# EAGLE schematic TSB Rev1 (EAGLE 9.6.2)

## Sheet 1 of 3
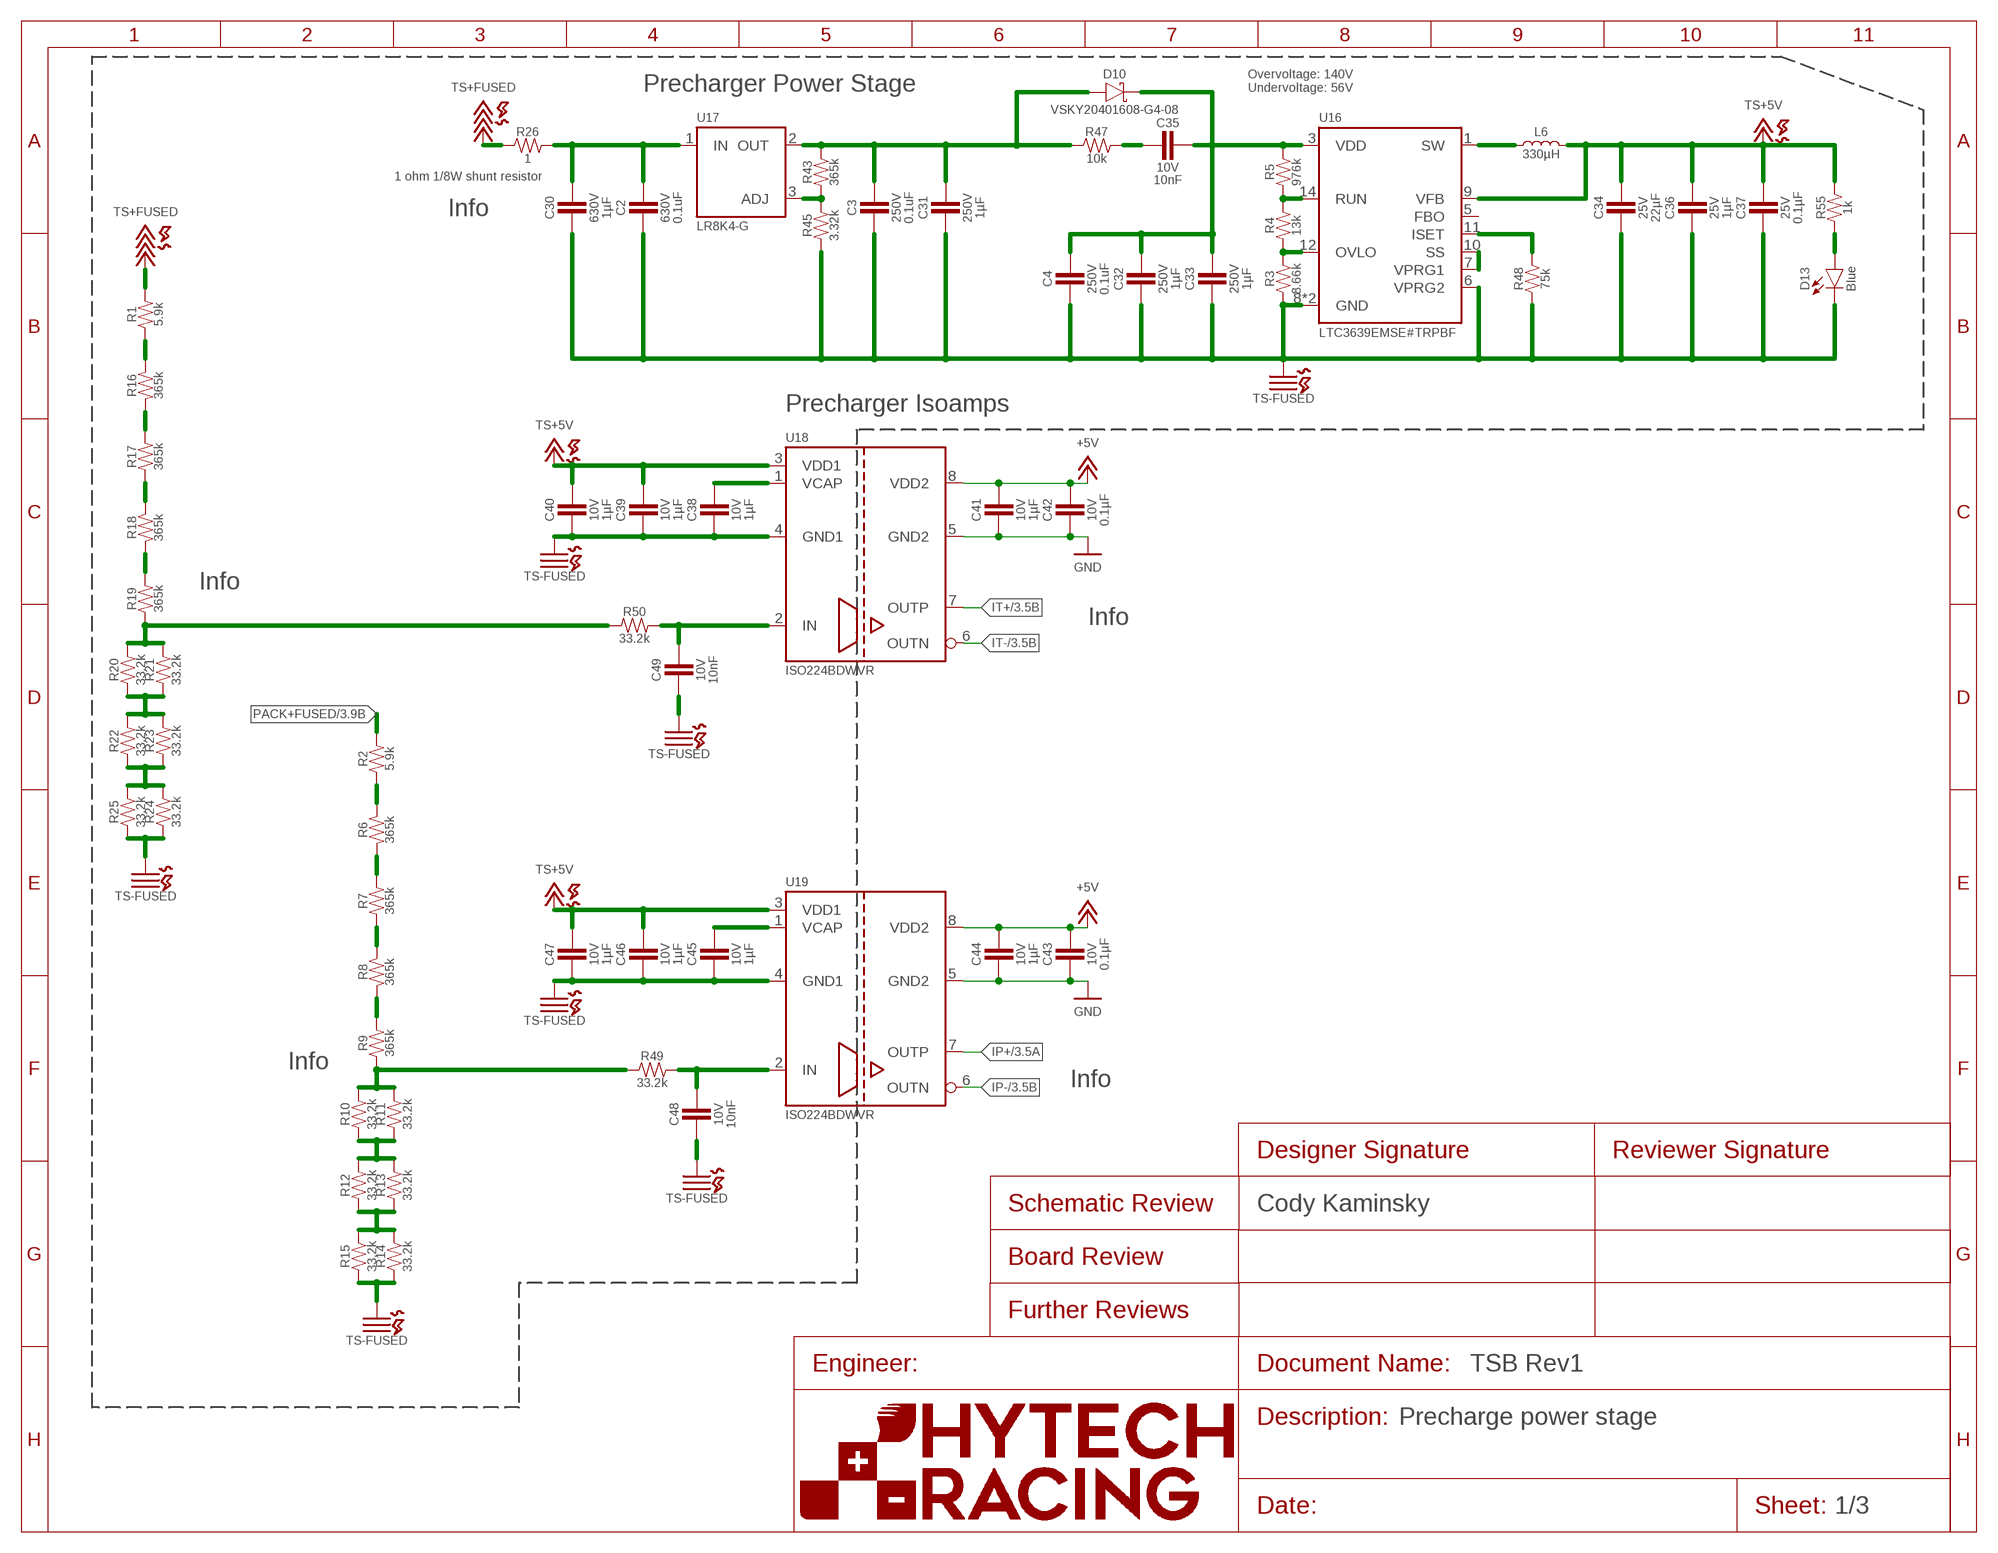
[diagram p0: schematic, sheet 1]
FRAME5 (FRAME): DESCRIPTION_1: Precharge power stage; DESIGNER_SCHEMATIC: Cody Kaminsky

### Parts
C2  CAPACITOR_2220_630V_0.1UF  [2220-CAP]
C3  CAPACITOR_1206_250V_0.1UF  [1206-CAP]
C4  CAPACITOR_1206_250V_0.1UF  [1206-CAP]
C30  CAPACITOR_2220_630V_1UF  [2220-CAP]
C31  CAPACITOR_2220_250V_1UF  [2220-CAP]
C32  CAPACITOR_2220_250V_1UF  [2220-CAP]
C33  CAPACITOR_2220_250V_1UF  [2220-CAP]
C34  CAPACITOR_0805_25V_22UF  [0805-CAP]
C35  CAPACITOR_0603_10V_10NF  [0603-CAP]
C36  CAPACITOR_0603_25V_1UF  [0603-CAP]
C37  CAPACITOR_0603_25V_0.1UF  [0603-CAP]
C38  CAPACITOR_0603_10V_1UF  [0603-CAP]
C39  CAPACITOR_0603_10V_1UF  [0603-CAP]
C40  CAPACITOR_0603_10V_1UF  [0603-CAP]
C41  CAPACITOR_0603_10V_1UF  [0603-CAP]
C42  CAPACITOR_0603_10V_0.1UF  [0603-CAP]
C43  CAPACITOR_0603_10V_0.1UF  [0603-CAP]
C44  CAPACITOR_0603_10V_1UF  [0603-CAP]
C45  CAPACITOR_0603_10V_1UF  [0603-CAP]
C46  CAPACITOR_0603_10V_1UF  [0603-CAP]
C47  CAPACITOR_0603_10V_1UF  [0603-CAP]
C48  CAPACITOR_0603_10V_10NF  [0603-CAP]
C49  CAPACITOR_0603_10V_10NF  [0603-CAP]
D10  SCHOTTKY  [CLP1608-2L]
D13  LED_0603_BLUE  [0603-LED]
L6  INDUCTOR_SRU1048_330UH  [SRU1048]
R1  RESISTOR_0603_5.9K  [0603-RES]
R2  RESISTOR_0603_5.9K  [0603-RES]
R3  RESISTOR_0603_8.66K  [0603-RES]
R4  RESISTOR_0603_13K  [0603-RES]
R5  RESISTOR_0805_976K  [0805-RES]
R6  RESISTOR_0805_365K  [0805-RES]
R7  RESISTOR_0805_365K  [0805-RES]
R8  RESISTOR_0805_365K  [0805-RES]
R9  RESISTOR_0805_365K  [0805-RES]
R10  RESISTOR_0603_33.2K  [0603-RES]
R11  RESISTOR_0603_33.2K  [0603-RES]
R12  RESISTOR_0603_33.2K  [0603-RES]
R13  RESISTOR_0603_33.2K  [0603-RES]
R14  RESISTOR_0603_33.2K  [0603-RES]
R15  RESISTOR_0603_33.2K  [0603-RES]
R16  RESISTOR_0805_365K  [0805-RES]
R17  RESISTOR_0805_365K  [0805-RES]
R18  RESISTOR_0805_365K  [0805-RES]
R19  RESISTOR_0805_365K  [0805-RES]
R20  RESISTOR_0603_33.2K  [0603-RES]
R21  RESISTOR_0603_33.2K  [0603-RES]
R22  RESISTOR_0603_33.2K  [0603-RES]
R23  RESISTOR_0603_33.2K  [0603-RES]
R24  RESISTOR_0603_33.2K  [0603-RES]
R25  RESISTOR_0603_33.2K  [0603-RES]
R26  RESISTOR_0805_1  [0805-RES]
R43  RESISTOR_0805_365K  [0805-RES]
R45  RESISTOR_0603_3.32K  [0603-RES]
R47  RESISTOR_0603_10K  [0603-RES]
R48  RESISTOR_0603_75K  [0603-RES]
R49  RESISTOR_0603_33.2K  [0603-RES]
R50  RESISTOR_0603_33.2K  [0603-RES]
R55  RESISTOR_0603_1K  [0603-RES]
U16  LTC3639  [MSE16(12)]
U17  VOLTAGE_REGULATOR_ADJ_LR8_DPAK  [DPAK(2-7K1S)]
U18  ISO224B_AIRGAP  [SOIC-08(WIDE,0.295")-AIRGAP]
U19  ISO224B_AIRGAP  [SOIC-08(WIDE,0.295")-AIRGAP]

### Nets
+5V: C41.1 C42.1 C43.1 C44.1 U18.8(VDD2) U19.8(VDD2) ; also sheet 2,3
GND: C41.2 C42.2 C43.2 C44.2 U18.5(GND2) U19.5(GND2) ; also sheet 2,3
IP+: U19.7(OUTP) ; also sheet 3
IP-: U19.6(OUTN) ; also sheet 3
IT+: U18.7(OUTP) ; also sheet 3
IT-: U18.6(OUTN) ; also sheet 3
N$2: R3.2 R4.1 U16.12(OVLO)
N$5: R4.2 R5.1 U16.14(RUN)
N$7: R6.2 R7.2
N$8: R7.1 R8.1
N$9: R1.1 R16.1
N$10: R2.1 R6.1
N$11: R8.2 R9.2
N$12: R20.1 R21.1 R22.2 R23.2
N$13: R9.1 R10.2 R11.2 R49.1
N$15: C2.1 C30.1 R26.2 U17.1(IN)
N$19: R16.2 R17.2
N$20: R17.1 R18.1
N$21: R18.2 R19.2
N$23: R19.1 R20.2 R21.2 R50.1
N$32: R12.1 R13.1 R14.2 R15.2
N$33: R22.1 R23.1 R24.2 R25.2
N$34: R10.1 R11.1 R12.2 R13.2
N$35: D13.2(A) R55.1
N$54: R43.1 R45.2 U17.3(ADJ)
N$58: C3.1 C31.1 D10.2(A) R43.2 R47.1 U17.2(OUT)
N$60: C35.2 R47.2
N$61: C4.1 C32.1 C33.1 C35.1 D10.1(C) R5.2 U16.3(VDD)
N$62: C48.1 R49.2 U19.2(IN)
N$63: C49.1 R50.2 U18.2(IN)
N$64: R48.2 U16.11(ISET)
N$65: L6.1 U16.1(SW)
N$69: C45.1 U19.1(VCAP)
N$73: C38.1 U18.1(VCAP)
N$76: U16.7(VPRG1) U16.10(SS)
PACK+FUSED: R2.2 ; also sheet 3
TS+5V: C34.1 C36.1 C37.1 C39.1 C40.1 C46.1 C47.1 L6.2 R55.2 U16.9(VFB) U18.3(VDD1) U19.3(VDD1) ; also sheet 3
TS+FUSED: R1.2 R26.1 ; also sheet 2,3
TS-FUSED: C2.2 C3.2 C4.2 C30.2 C31.2 C32.2 C33.2 C34.2 C36.2 C37.2 C38.2 C39.2 C40.2 C45.2 C46.2 C47.2 C48.2 C49.2 D13.1(C) R3.1 R14.1 R15.1 R24.1 R25.1 R45.1 R48.1 U16.6(VPRG2) U16.8(GND) U16.16(GND) U18.4(GND1) U19.4(GND1) ; also sheet 2,3
Unconnected: U16.5(FBO)

### Notes on the sheet
- Precharger Power Stage
- Overvoltage: 140V
  Undervoltage: 56V
- 1 ohm 1/8W shunt resistor
- Info
- Precharger Isoamps
- Info
- Info
- Info
- Info

## Sheet 2 of 3
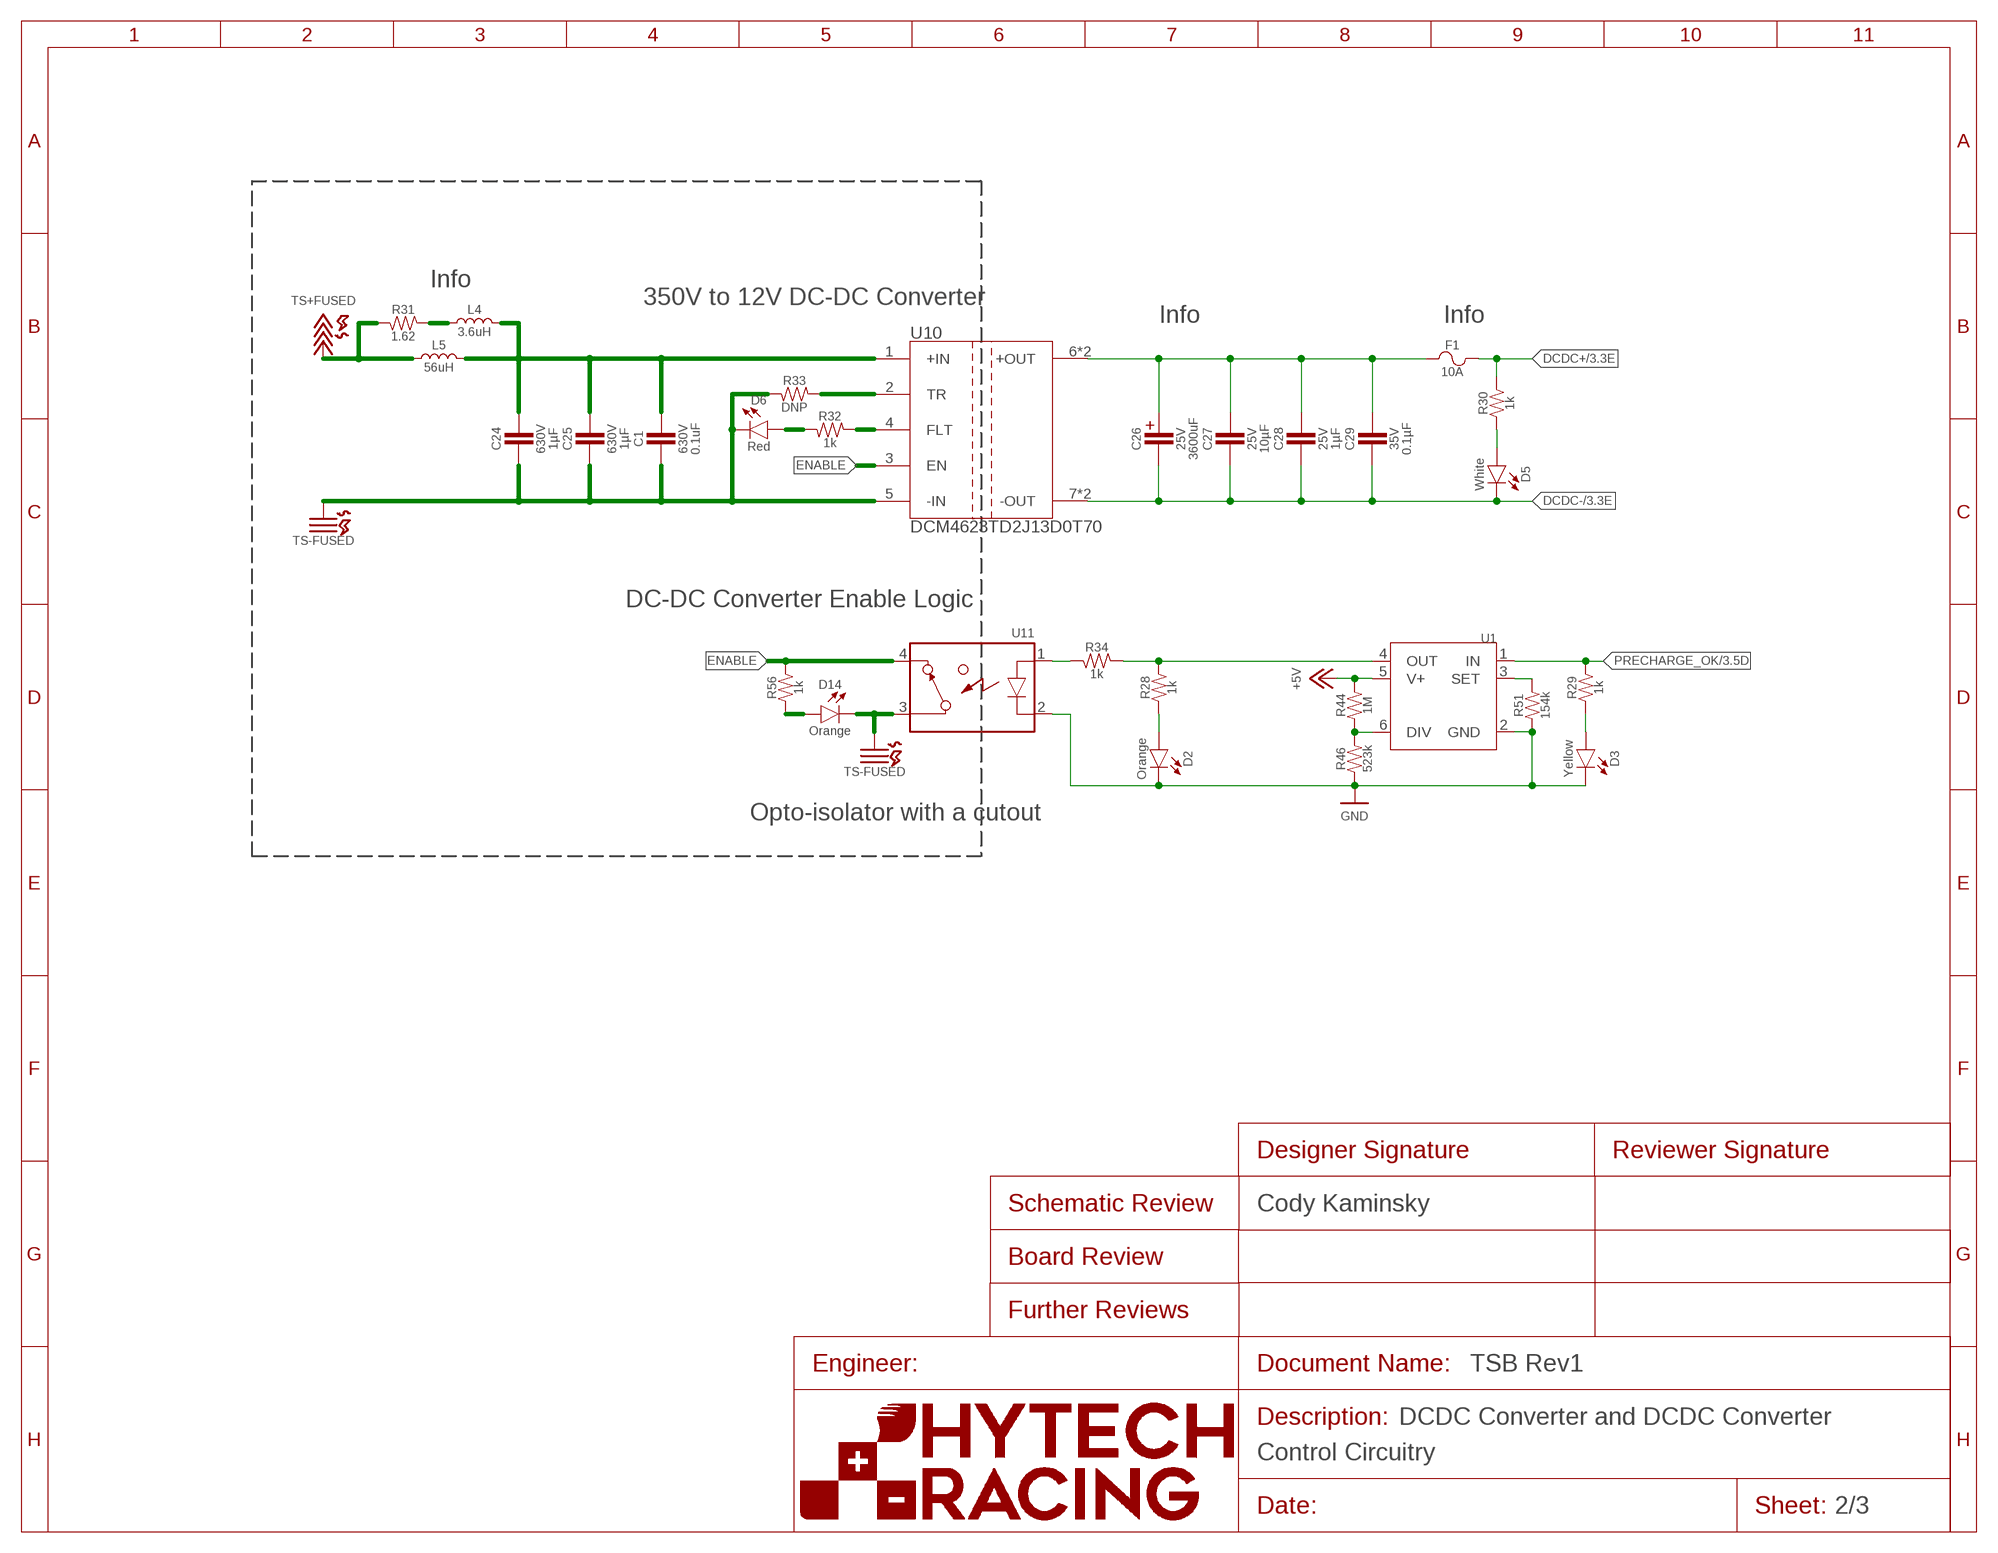
[diagram p1: schematic, sheet 2]
FRAME3 (FRAME): DESCRIPTION_1: DCDC Converter and DCDC Converter; DESCRIPTION_2: Control Circuitry; DESIGNER_SCHEMATIC: Cody Kaminsky

### Parts
C1  CAPACITOR_2220_630V_0.1UF  [2220-CAP]
C24  CAPACITOR_2220_630V_1UF  [2220-CAP]
C25  CAPACITOR_2220_630V_1UF  [2220-CAP]
C26  CAPACITOR_POLAR__  [EKYC*MM]
C27  CAPACITOR_0603_25V_10UF  [0603-CAP]
C28  CAPACITOR_0603_25V_1UF  [0603-CAP]
C29  CAPACITOR_0603_35V_0.1UF  [0603-CAP]
D2  LED_0603_ORANGE  [0603-LED]
D3  LED_0603_YELLOW  [0603-LED]
D5  LED_0603_WHITE  [0603-LED]
D6  LED_0603_RED  [0603-LED]
D14  LED_0603_ORANGE  [0603-LED]
F1  FUSE__  [MINI-BLADE_FUSE_HOLDER]
L4  INDUCTOR_PA4334_  [PA4334]
L5  INDUCTOR_WELMHI_  [WE-LMHI]
R28  RESISTOR_0603_1K  [0603-RES]
R29  RESISTOR_0603_1K  [0603-RES]
R30  RESISTOR_0603_1K  [0603-RES]
R31  RESISTOR_0603_1.62  [0603-RES]
R32  RESISTOR_0603_1K  [0603-RES]
R33  RESISTOR_0603_DNP  [0603-RES]
R34  RESISTOR_0603_1K  [0603-RES]
R44  RESISTOR_0805_1M  [0805-RES]
R46  RESISTOR_0805_523K  [0805-RES]
R51  RESISTOR_0603_154K  [0603-RES]
R56  RESISTOR_0603_1K  [0603-RES]
U1  LTC6994_1  [SOT-23-6]
U10  DCM4623TD2J13D0T70  [DCM4623]
U11  RELAY_SOLIDSTATE_NC_AG  [DIP-4_AIRGAP]

### Nets
+5V: R44.2 U1.5(V+) ; also sheet 1,3
DCDC+: F1.L1 F1.L2 R30.2 ; also sheet 3
DCDC-: C26.-(MINUS) C27.1 C28.1 C29.1 D5.1(C) U10.7(-OUT) U10.9(-OUT) ; also sheet 3
ENABLE: R56.2 U10.3(EN) U11.4(CONTACT2)
GND: D2.1(C) D3.1(C) R46.1 R51.1 U1.2(GND) U11.2(CONTROL-) ; also sheet 1,3
N$1: D14.2(A) R56.1
N$4: R44.1 R46.2 U1.6(DIV)
N$6: R34.2 U11.1(CONTROL+)
N$14: R51.2 U1.3(SET)
N$16: R28.2 R34.1 U1.4(OUT)
N$17: D2.2(A) R28.1
N$18: D5.2(A) R30.1
N$22: D3.2(A) R29.1
N$29: L4.2 R31.1
N$39: C1.1 C24.1 C25.1 L4.1 L5.1 U10.1(+IN)
N$43: D6.2(A) R32.2
N$44: R32.1 U10.4(FLT)
N$45: R33.1 U10.2(TR)
N$46: C26.+(PLUS) C27.2 C28.2 C29.2 F1.R1 F1.R2 U10.6(+OUT) U10.8(+OUT)
PRECHARGE_OK: R29.2 U1.1(IN) ; also sheet 3
TS+FUSED: L5.2 R31.2 ; also sheet 1,3
TS-FUSED: C1.2 C24.2 C25.2 D6.1(C) D14.1(C) R33.2 U10.5(-IN) U11.3(CONTACT1) ; also sheet 1,3

### Notes on the sheet
- Info
- 350V to 12V DC-DC Converter
- Info | Info
- DC-DC Converter Enable Logic
- Opto-isolator with a cutout

## Sheet 3 of 3
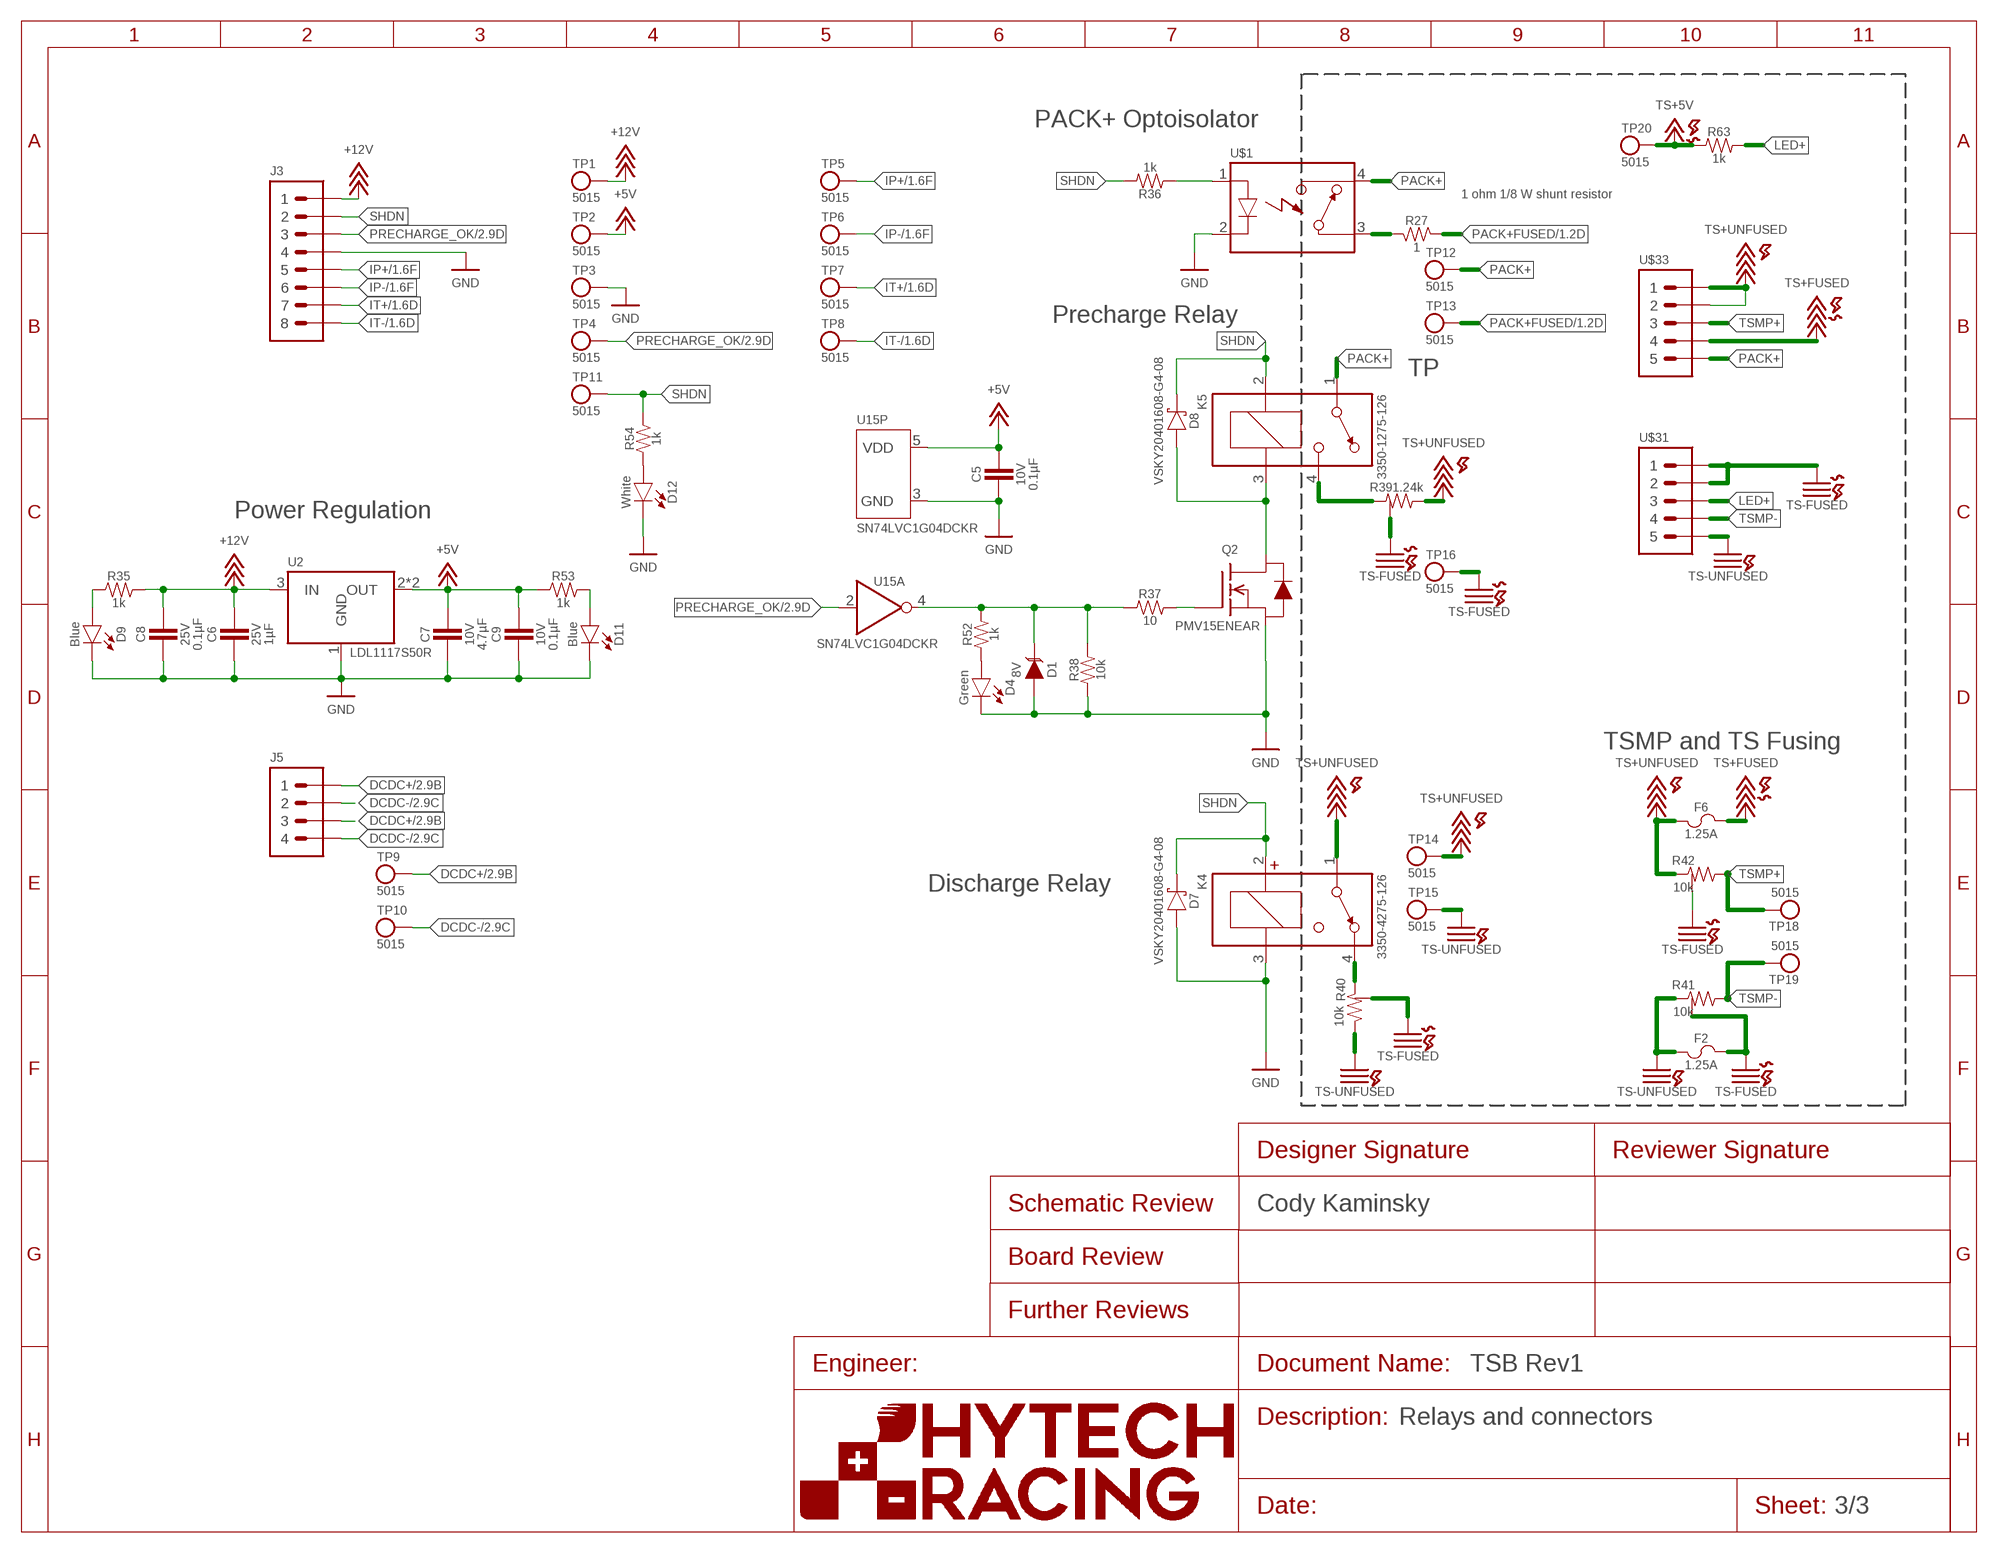
[diagram p2: schematic, sheet 3]
FRAME4 (FRAME): DESCRIPTION_1: Relays and connectors; DESIGNER_SCHEMATIC: Cody Kaminsky

### Parts
C5  CAPACITOR_0603_10V_0.1UF  [0603-CAP]
C6  CAPACITOR_0603_25V_1UF  [0603-CAP]
C7  CAPACITOR_0603_10V_4.7UF  [0603-CAP]
C8  CAPACITOR_0603_25V_0.1UF  [0603-CAP]
C9  CAPACITOR_0603_10V_0.1UF  [0603-CAP]
D1  TVS_8V  [SOT-23]
D4  LED_0603_GREEN  [0603-LED]
D7  SCHOTTKY  [CLP1608-2L]
D8  SCHOTTKY  [CLP1608-2L]
D9  LED_0603_BLUE  [0603-LED]
D11  LED_0603_BLUE  [0603-LED]
D12  LED_0603_WHITE  [0603-LED]
F2  FUSE_0885_1.25  [0885]
F6  FUSE_0885_1.25  [0885]
J3  CONNECTOR-8_MF_T_V_  [MOLEX_MICROFIT_PTH_VERTICAL_08_DUAL]
J5  CONNECTOR-4__  [MOLEX_MICROFIT_PTH_VERTICAL_04_DUAL]
K4  RELAY_SPST_NC_POLARIZED_3550_12  [335X]
K5  RELAY_SPST_NO_3550_12  [335X]
Q2  TRANSISTOR_N_MOS__PMV15ENEA  [SOT-23]
R27  RESISTOR_0805_1  [0805-RES]
R35  RESISTOR_0603_1K  [0603-RES]
R36  RESISTOR_0603_1K  [0603-RES]
R37  RESISTOR_0603_10  [0603-RES]
R38  RESISTOR_0603_10K  [0603-RES]
R39  RESISTOR_GND_1.24K  [B20]
R40  RESISTOR_GND_10K  [B20]
R41  RESISTOR_GND_10K  [B20]
R42  RESISTOR_GND_10K  [B20]
R52  RESISTOR_0603_1K  [0603-RES]
R53  RESISTOR_0603_1K  [0603-RES]
R54  RESISTOR_0603_1K  [0603-RES]
R63  RESISTOR_0603_1K  [0603-RES]
TP1  TEST_POINT  [MICRO_MINIATURE]
TP2  TEST_POINT  [MICRO_MINIATURE]
TP3  TEST_POINT  [MICRO_MINIATURE]
TP4  TEST_POINT  [MICRO_MINIATURE]
TP5  TEST_POINT  [MICRO_MINIATURE]
TP6  TEST_POINT  [MICRO_MINIATURE]
TP7  TEST_POINT  [MICRO_MINIATURE]
TP8  TEST_POINT  [MICRO_MINIATURE]
TP9  TEST_POINT  [MICRO_MINIATURE]
TP10  TEST_POINT  [MICRO_MINIATURE]
TP11  TEST_POINT  [MICRO_MINIATURE]
TP12  TEST_POINT  [MICRO_MINIATURE]
TP13  TEST_POINT  [MICRO_MINIATURE]
TP14  TEST_POINT  [MICRO_MINIATURE]
TP15  TEST_POINT  [MICRO_MINIATURE]
TP16  TEST_POINT  [MICRO_MINIATURE]
TP18  TEST_POINT  [MICRO_MINIATURE]
TP19  TEST_POINT  [MICRO_MINIATURE]
TP20  TEST_POINT  [MICRO_MINIATURE]
U2  VOLTAGE_REGULATOR_SOT223_5V  [SOT223]
U15  LOGICGATE_INVERTER_DCKR  [SC-70-5]
U$1  RELAY_SOLIDSTATE_NO_AG  [DIP-4_AIRGAP]
U$31  CONNECTOR-5_6_SPACED_  [MOLEX_MICROFIT_PTH_VERTICAL_06_SINGLE_SPACED]
U$33  CONNECTOR-5_7_SPACED_  [MOLEX_MICROFIT_PTH_VERTICAL_07_DUAL_SPACED]

### Nets
+5V: C5.1 C7.1 C9.1 R53.1 TP2.1 U2.2(OUT) U2.4(OUT) U15.5(P:VDD) ; also sheet 1,2
+12V: C6.1 C8.1 J3.1 R35.2 TP1.1 U2.3(IN)
DCDC+: J5.1 J5.3 TP9.1 ; also sheet 2
DCDC-: J5.2 J5.4 TP10.1 ; also sheet 2
GND: C5.2 C6.2 C7.2 C8.2 C9.2 D1.1(A) D4.1(C) D7.2(A) D9.1(C) D11.1(C) D12.1(C) J3.4 K4.3(COIL-) Q2.2(S) R38.1 TP3.1 U2.1(GND) U15.3(P:GND) U$1.2(CONTROL-) ; also sheet 1,2
IP+: J3.5 TP5.1 ; also sheet 1
IP-: J3.6 TP6.1 ; also sheet 1
IT+: J3.7 TP7.1 ; also sheet 1
IT-: J3.8 TP8.1 ; also sheet 1
LED+: R63.2 U$31.3
N$3: Q2.1(G) R37.2
N$24: D4.2(A) R52.1
N$25: D9.2(A) R35.1
N$30: D11.2(A) R53.2
N$31: D12.2(A) R54.1
N$40: D8.2(A) K5.3(COIL-) Q2.3(D)
N$50: K5.4(CONTACT2) R39.1
N$51: K4.4(CONTACT2) R40.1
N$52: D1.3(C) R37.1 R38.2 R52.2 U15.4(A:!IN)
N$53: R36.1 U$1.1(CONTROL+)
N$57: R27.2 U$1.3(CONTACT1)
PACK+: K5.1(CONTACT1) TP12.1 U$1.4(CONTACT2) U$33.5
PACK+FUSED: R27.1 TP13.1 ; also sheet 1
PRECHARGE_OK: J3.3 TP4.1 U15.2(A:IN) ; also sheet 2
SHDN: D7.1(C) D8.1(C) J3.2 K4.2(COIL+) K5.2(COIL+) R36.2 R54.2 TP11.1
TS+5V: R63.1 TP20.1 ; also sheet 1
TS+FUSED: F6.2 U$33.4 ; also sheet 1,2
TS+UNFUSED: F6.1 K4.1(CONTACT1) R39.2 R42.1 TP14.1 U$33.1 U$33.2
TS-FUSED: F2.2 R39.3 R39.4 R39.5 R39.6 R40.3 R40.4 R40.5 R40.6 R41.3 R41.4 R41.5 R41.6 R42.3 R42.4 R42.5 R42.6 TP16.1 U$31.1 U$31.2 ; also sheet 1,2
TS-UNFUSED: F2.1 R40.2 R41.1 TP15.1 U$31.5
TSMP+: R42.2 TP18.1 U$33.3
TSMP-: R41.2 TP19.1 U$31.4

### Notes on the sheet
- PACK+ Optoisolator
- 1 ohm 1/8 W shunt resistor
- Precharge Relay
- TP
- Power Regulation
- TSMP and TS Fusing
- Discharge Relay

## Library data of the parts
C1 C2 = HyTechDevices:CAPACITOR_?_*: Capacitor, Non-Polarized VJ...1BC Series Datasheet Samsung Datasheet Walsin Datasheet GRM188R61A226ME15D GRM188R61E106MA73D 885012006013 2220Y6300105KXTWS2 Yageo Class 2, X5R TDK C Series AVX Automotive MLCC KEMET X7R Series; CAPACITANCE: 0.1uF; DKPN: 445-11980-2-ND; MANUFACTURER: TDK Coporation; MPN: C5750CH2J104K280KC; TOLERANCE: 10%; VOLTAGE: 630V
C3 C4 = HyTechDevices:CAPACITOR_?_*: Capacitor, Non-Polarized VJ...1BC Series Datasheet Samsung Datasheet Walsin Datasheet GRM188R61A226ME15D GRM188R61E106MA73D 885012006013 2220Y6300105KXTWS2 Yageo Class 2, X5R TDK C Series AVX Automotive MLCC KEMET X7R Series; CAPACITANCE: 0.1uF; DKPN: 445-6079-2-ND; MANUFACTURER: TDK Corporation; MPN: C3216X7R2E104K160AM; TOLERANCE: 10%; VOLTAGE: 250V
C5 C9 C42 C43 = HyTechDevices:CAPACITOR_?_*: Capacitor, Non-Polarized VJ...1BC Series Datasheet Samsung Datasheet Walsin Datasheet GRM188R61A226ME15D GRM188R61E106MA73D 885012006013 2220Y6300105KXTWS2 Yageo Class 2, X5R TDK C Series AVX Automotive MLCC KEMET X7R Series; CAPACITANCE: 0.1µF; DKPN: 720-1688-1-ND; MANUFACTURER: Vishay Vitramon; MOPN: 77-VJ0603Y104JXQPBC; MPN: VJ0603Y104JXQPW1BC; TOLERANCE: 5%; VOLTAGE: 10V
C6 C28 C36 = HyTechDevices:CAPACITOR_?_*: Capacitor, Non-Polarized VJ...1BC Series Datasheet Samsung Datasheet Walsin Datasheet GRM188R61A226ME15D GRM188R61E106MA73D 885012006013 2220Y6300105KXTWS2 Yageo Class 2, X5R TDK C Series AVX Automotive MLCC KEMET X7R Series; CAPACITANCE: 1µF; DKPN: 1276-1184-1-ND; MANUFACTURER: Samsung Electro-Mechanics; MOPN: 187-CL10B105KA8NNNC; MPN: CL10B105KA8NNNC; TOLERANCE: 10%; VOLTAGE: 25V
C7 = HyTechDevices:CAPACITOR_?_*: Capacitor, Non-Polarized VJ...1BC Series Datasheet Samsung Datasheet Walsin Datasheet GRM188R61A226ME15D GRM188R61E106MA73D 885012006013 2220Y6300105KXTWS2 Yageo Class 2, X5R TDK C Series AVX Automotive MLCC KEMET X7R Series; CAPACITANCE: 4.7µF; DKPN: 1276-1044-1-ND; MANUFACTURER: Samsung Electro-Mechanics; MOPN: 187-CL10A475KP8NNNC; MPN: CL10A475KP8NNNC; TOLERANCE: 10%; VOLTAGE: 10V
C8 C37 = HyTechDevices:CAPACITOR_?_*: Capacitor, Non-Polarized VJ...1BC Series Datasheet Samsung Datasheet Walsin Datasheet GRM188R61A226ME15D GRM188R61E106MA73D 885012006013 2220Y6300105KXTWS2 Yageo Class 2, X5R TDK C Series AVX Automotive MLCC KEMET X7R Series; CAPACITANCE: 0.1µF; DKPN: 1276-1006-1-ND; MANUFACTURER: Samsung Electro-Mechanics; MOPN: 187-CL10B104KA8NNNC; MPN: CL10B104KA8NNNC; TOLERANCE: 10%; VOLTAGE: 25V
C24 C25 C30 = HyTechDevices:CAPACITOR_?_*: Capacitor, Non-Polarized VJ...1BC Series Datasheet Samsung Datasheet Walsin Datasheet GRM188R61A226ME15D GRM188R61E106MA73D 885012006013 2220Y6300105KXTWS2 Yageo Class 2, X5R TDK C Series AVX Automotive MLCC KEMET X7R Series; CAPACITANCE: 1µF; DKPN: 1608-2220Y6300105KXTWS2CT-ND; MANUFACTURER: Knowles Syfer; MOPN: 843-2220Y63105KXTWS2; MPN: 2220Y6300105KXTWS2; TOLERANCE: 10%; VOLTAGE: 630V
C26 = HyTechDevices:CAPACITOR_POLAR_?_*; CAPACITANCE: 3600uF; DKPN: 565-EKYC250ELL362ML20S-ND; MANUFACTURER: United Chemi-con; MOPN: 661-YC250ELL362ML20S; MPN: EKYC250ELL362ML20S; VOLTAGE: 25V
C27 = HyTechDevices:CAPACITOR_?_*: Capacitor, Non-Polarized VJ...1BC Series Datasheet Samsung Datasheet Walsin Datasheet GRM188R61A226ME15D GRM188R61E106MA73D 885012006013 2220Y6300105KXTWS2 Yageo Class 2, X5R TDK C Series AVX Automotive MLCC KEMET X7R Series; CAPACITANCE: 10µF; DKPN: 490-7202-1-ND; MANUFACTURER: Murata Electronics; MOPN: 81-GRM188R61E106MA3D; MPN: GRM188R61E106MA73D; TOLERANCE: 20%; VOLTAGE: 25V
C29 = HyTechDevices:CAPACITOR_?_*: Capacitor, Non-Polarized VJ...1BC Series Datasheet Samsung Datasheet Walsin Datasheet GRM188R61A226ME15D GRM188R61E106MA73D 885012006013 2220Y6300105KXTWS2 Yageo Class 2, X5R TDK C Series AVX Automotive MLCC KEMET X7R Series; CAPACITANCE: 0.1µF; DKPN: 587-3354-1-ND; MANUFACTURER: Taiyo Yuden; MOPN: 963-GMK107B7104KAHT; MPN: GMK107B7104KAHT; TOLERANCE: 10%; VOLTAGE: 35V
C31-C33 = HyTechDevices:CAPACITOR_?_*: Capacitor, Non-Polarized VJ...1BC Series Datasheet Samsung Datasheet Walsin Datasheet GRM188R61A226ME15D GRM188R61E106MA73D 885012006013 2220Y6300105KXTWS2 Yageo Class 2, X5R TDK C Series AVX Automotive MLCC KEMET X7R Series; CAPACITANCE: 1µF; DKPN: 445-2304-2-ND; MANUFACTURER: TDK Corporation; MOPN: 810-C5750X7R2E105K; MPN: C5750X7R2E105K230KA; TOLERANCE: 10%; VOLTAGE: 250V
C34 = HyTechDevices:CAPACITOR_?_*: Capacitor, Non-Polarized VJ...1BC Series Datasheet Samsung Datasheet Walsin Datasheet GRM188R61A226ME15D GRM188R61E106MA73D 885012006013 2220Y6300105KXTWS2 Yageo Class 2, X5R TDK C Series AVX Automotive MLCC KEMET X7R Series; CAPACITANCE: 22µF; DKPN: 311-1903-1-ND; MANUFACTURER: Yageo; MOPN: 603-CC805MKX5R8BB226; MPN: CC0805MKX5R8BB226; TOLERANCE: 20%; VOLTAGE: 25V
C35 C48 C49 = HyTechDevices:CAPACITOR_?_*: Capacitor, Non-Polarized VJ...1BC Series Datasheet Samsung Datasheet Walsin Datasheet GRM188R61A226ME15D GRM188R61E106MA73D 885012006013 2220Y6300105KXTWS2 Yageo Class 2, X5R TDK C Series AVX Automotive MLCC KEMET X7R Series; CAPACITANCE: 10nF; DKPN: 311-4054-1-ND; MANUFACTURER: Yageo; MOPN: 603-CC603KRX7R6BB103; MPN: CC0603KRX7R6BB103; TOLERANCE: 10%; VOLTAGE: 10V
C38-C41 C44-C47 = HyTechDevices:CAPACITOR_?_*: Capacitor, Non-Polarized VJ...1BC Series Datasheet Samsung Datasheet Walsin Datasheet GRM188R61A226ME15D GRM188R61E106MA73D 885012006013 2220Y6300105KXTWS2 Yageo Class 2, X5R TDK C Series AVX Automotive MLCC KEMET X7R Series; CAPACITANCE: 1µF; DKPN: 311-1796-1-ND; MANUFACTURER: Yageo; MOPN: 603-CC603KRX7R6BB105; MPN: CC0603KRX7R6BB105; TOLERANCE: 10%; VOLTAGE: 10V
D1 = HyTechDevices:TVS_*: TVS Diode GSOT Datasheet; DKPN: GSOT08-E3-08TR-ND; MANUFACTURER: Vishay General Semiconductor - Diodes Division; MOPN: 78-GSOT08-E3-08; MPN: GSOT08-E3-08; VOLTAGE: 8V
D2 D14 = HyTechDevices:LED_?_*: LED Blue Green Orange Red White Yellow; COLOR: Orange; DKPN: 754-1120-1-ND; MANUFACTURER: Kingbright; MOPN: 604-APT1608SECK; MPN: APT1608SECK
D3 = HyTechDevices:LED_?_*: LED Blue Green Orange Red White Yellow; COLOR: Yellow; DKPN: 754-1788-1-ND; MANUFACTURER: Kingbright; MOPN: 604-APT1608SYCK/J3-PRV; MPN: APT1608SYCK/J3-PRV
D4 = HyTechDevices:LED_?_*: LED Blue Green Orange Red White Yellow; COLOR: Green; DKPN: 754-1790-1-ND; MANUFACTURER: Kingbright; MOPN: 604-APT1608ZGCK; MPN: APT1608ZGCK
D5 D12 = HyTechDevices:LED_?_*: LED Blue Green Orange Red White Yellow; COLOR: White; DKPN: SM0603UWC-ND; MANUFACTURER: Bivar Inc.; MOPN: 749-SM0603UWC; MPN: SM0603UWC
D6 = HyTechDevices:LED_?_*: LED Blue Green Orange Red White Yellow; COLOR: Red; DKPN: 754-1786-1-ND; MANUFACTURER: Kingbright; MOPN: 604-APT1608SECKJ3PRV; MPN: APT1608SECK/J3-PRV
D7 D8 D10 = HyTechDevices:SCHOTTKY: Schottky Rectifier Diode Datasheet; DKPN: 112-VSKY20401608-G4-08CT-ND; MANUFACTURER: Vishay General Semiconductor - Diodes Division; MOPN: 78-VSKY20401608G408; MPN: VSKY20401608-G4-08
D9 D11 D13 = HyTechDevices:LED_?_*: LED Blue Green Orange Red White Yellow; COLOR: Blue; DKPN: 754-1789-1-ND; MANUFACTURER: Kingbright; MOPN: 604-APT1608VBC/D; MPN: APT1608VBC/D
F1 = HyTechDevices:FUSE_?_*: Fuse 0885 Series; CURRENT: 10A; DKPN: F991-ND; MANUFACTURER: Littelfuse Inc.; MOPN: 576-0297010.WXNV; MPN: 0297010.WXNV; VOLTAGE: 32V
F2 F6 = HyTechDevices:FUSE_?_*: Fuse 0885 Series; CURRENT: 1.25A; DKPN: F10986CT-ND; MANUFACTURER: Littelfuse Inc.; MOPN: 576-08851.25DR; MPN: 08851.25DR; VOLTAGE: 500V
J3 = HyTechDevices:CONNECTOR-8_?_*: 8 Pin Connector
J5 = HyTechDevices:CONNECTOR-4_?_*
K4 = HyTechDevices:RELAY_SPST_NC_POLARIZED_?*: Single Pole, Single Throw Normally Closed Polarized Relay 355x Series D Series; DKPN: 1835-1040-ND; MANUFACTURER: Comus International; MPN: 3350-4275-126
K5 = HyTechDevices:RELAY_SPST_NO_?*: Single Pole, Single Throw Relay Normally Open 355x Series; DKPN: 1835-1037-ND; MANUFACTURER: Comus International; MPN: 3350-1275-126
L4 = HyTechDevices:INDUCTOR_?_*: Inductor 74451133 Inductor SRU1408 Datasheet; CURRENT_RATED: 1.6A; CURRENT_SATURATION: 1A; DCR: 0.13; DKPN: 553-3508-2-ND; INDUCTANCE: 3.6uH; MANUFACTURER: Pulse Electonics Company
L5 = HyTechDevices:INDUCTOR_?_*: Inductor 74451133 Inductor SRU1408 Datasheet; INDUCTANCE: 56uH
L6 = HyTechDevices:INDUCTOR_?_*: Inductor 74451133 Inductor SRU1408 Datasheet; CURRENT_RATED: 0.65A; CURRENT_SATURATION: 0.52A; DCR: 0.640Ω; DKPN: SRU1048-331YTR-ND; INDUCTANCE: 330µH; MANUFACTURER: Bourns Inc.; MOPN: 652-SRU1048-331Y; MPN: SRU1048-331Y; TOLERANCE: 30%
Q2 = HyTechDevices:TRANSISTOR_N_MOS_?_*: N-MOSFET PMV15ENEA Datasheet TK6P65W Datasheet SIR638ADP Datasheet; DKPN: 1727-8588-1-ND; MANUFACTURER: Nexperia USA Inc.; MOPN: 771-PMV15ENEAR; MPN: PMV15ENEAR
R1 R2 = HyTechDevices:RESISTOR_?_*: Resistor PWR163 Series AC Series PU Series ERA Series PWR263 Series RC Series ERJ PB3, PB6 Series ERJ PA2, P03, PA3, P06, P08, P14 Series; DKPN: P5.9KDBCT-ND; MANUFACTURER: Panasonic Electronic Components; MOPN: 667-ERA-3AEB5901V; MPN: ERA-3AEB5901V; POWER: 0.1W; RESISTANCE: 5.9k; TOLERANCE: 0.1%; VOLTAGE_CONTINUOUS: 24.29V; VOLTAGE_MAX: 75V
R3 = HyTechDevices:RESISTOR_?_*: Resistor PWR163 Series AC Series PU Series ERA Series PWR263 Series RC Series ERJ PB3, PB6 Series ERJ PA2, P03, PA3, P06, P08, P14 Series; DKPN: YAG4603TR-ND; MANUFACTURER: Yageo; MOPN: 603-RT0603BRD078K66L; MPN: RT0603BRD078K66L; POWER: 0.1W; RESISTANCE: 8.66k; TOLERANCE: 0.1%; VOLTAGE_CONTINUOUS: 29.43V; VOLTAGE_MAX: 75V
R4 = HyTechDevices:RESISTOR_?_*: Resistor PWR163 Series AC Series PU Series ERA Series PWR263 Series RC Series ERJ PB3, PB6 Series ERJ PA2, P03, PA3, P06, P08, P14 Series; DKPN: P20098TR-ND; MANUFACTURER: Panasonic Electronic Components; MOPN: 667-ERJ-PB3B1302V; MPN: ERJ-PB3B1302V; POWER: 0.1W; RESISTANCE: 13k; TOLERANCE: 0.1%; VOLTAGE_MAX: 75V
R5 = HyTechDevices:RESISTOR_?_*: Resistor PWR163 Series AC Series PU Series ERA Series PWR263 Series RC Series ERJ PB3, PB6 Series ERJ PA2, P03, PA3, P06, P08, P14 Series; DKPN: P20935TR-ND; MANUFACTURER: Panasonic Electronic Components; MOPN: 667-ERJ-PB6B9763V; MPN: ERJ-PB6B9763V; POWER: 0.25W; RESISTANCE: 976k; TOLERANCE: 0.1%; VOLTAGE_CONTINUOUS: 150V; VOLTAGE_MAX: 150V
R6-R9 R16-R19 R43 = HyTechDevices:RESISTOR_?_*: Resistor PWR163 Series AC Series PU Series ERA Series PWR263 Series RC Series ERJ PB3, PB6 Series ERJ PA2, P03, PA3, P06, P08, P14 Series; DKPN: P20885CT-ND; MANUFACTURER: Panasonic Electronic Components; MOPN: 667-ERJ-PB6B3653V; MPN: ERJ-PB6B3653V; POWER: 0.25W; RESISTANCE: 365k; TOLERANCE: 0.1%; VOLTAGE_CONTINUOUS: 150V; VOLTAGE_MAX: 150V
R10-R15 R20-R25 R49 R50 = HyTechDevices:RESISTOR_?_*: Resistor PWR163 Series AC Series PU Series ERA Series PWR263 Series RC Series ERJ PB3, PB6 Series ERJ PA2, P03, PA3, P06, P08, P14 Series; DKPN: P20144TR-ND; MANUFACTURER: Panasonic Electronic Components; MOPN: 667-ERJ-PB3B3322V; MPN: ERJ-PB3B3322V; POWER: 0.1W; RESISTANCE: 33.2k; TOLERANCE: 0.1%; VOLTAGE_MAX: 75V
R26 R27 = HyTechDevices:RESISTOR_?_*: Resistor PWR163 Series AC Series PU Series ERA Series PWR263 Series RC Series ERJ PB3, PB6 Series ERJ PA2, P03, PA3, P06, P08, P14 Series; DKPN: P1.0DTR-ND; MANUFACTURER: Panasonic Electronic Components; MOPN: 667-ERJ-6RQF1R0V; MPN: ERJ-6RQF1R0V; POWER: 0.125W; RESISTANCE: 1; TOLERANCE: 1%; VOLTAGE_MAX: 150V
R28-R30 R32 R34-R36 R52-R56 R63 = HyTechDevices:RESISTOR_?_*: Resistor PWR163 Series AC Series PU Series ERA Series PWR263 Series RC Series ERJ PB3, PB6 Series ERJ PA2, P03, PA3, P06, P08, P14 Series; DKPN: 311-1.00KHRCT-ND; MANUFACTURER: Yageo; MOPN: 603-RC0603FR-071KL; MPN: RC0603FR-071KL; POWER: 0.1W; RESISTANCE: 1k; TOLERANCE: 1%; VOLTAGE_CONTINUOUS: 10.00V; VOLTAGE_MAX: 75V
R31 = HyTechDevices:RESISTOR_?_*: Resistor PWR163 Series AC Series PU Series ERA Series PWR263 Series RC Series ERJ PB3, PB6 Series ERJ PA2, P03, PA3, P06, P08, P14 Series; DKPN: 1712-CPF0603B1R62E1TR-ND; MANUFACTURER: TE Conductivity Passive Product; MOPN: 279-CPF0603B1R62E1; MPN: CPF0603B1R62E1; POWER: 0.1W; RESISTANCE: 1.62; TOLERANCE: 0.1%; VOLTAGE_CONTINUOUS: 0.51V; VOLTAGE_MAX: 50V
R33 = HyTechDevices:RESISTOR_?_*: Resistor PWR163 Series AC Series PU Series ERA Series PWR263 Series RC Series ERJ PB3, PB6 Series ERJ PA2, P03, PA3, P06, P08, P14 Series; RESISTANCE: DNP
R37 = HyTechDevices:RESISTOR_?_*: Resistor PWR163 Series AC Series PU Series ERA Series PWR263 Series RC Series ERJ PB3, PB6 Series ERJ PA2, P03, PA3, P06, P08, P14 Series; DKPN: 311-10.0HRCT-ND; MANUFACTURER: Yageo; MOPN: 603-RC0603FR-0710RL; MPN: RC0603FR-0710RL; POWER: 0.1W; RESISTANCE: 10; TOLERANCE: 1%; VOLTAGE_CONTINUOUS: 1V; VOLTAGE_MAX: 75V
R38 R47 = HyTechDevices:RESISTOR_?_*: Resistor PWR163 Series AC Series PU Series ERA Series PWR263 Series RC Series ERJ PB3, PB6 Series ERJ PA2, P03, PA3, P06, P08, P14 Series; DKPN: 311-10.0KHRCT-ND; MANUFACTURER: Yageo; MOPN: 603-RC0603FR-0710KL; MPN: RC0603FR-0710KL; POWER: 0.1W; RESISTANCE: 10k; TOLERANCE: 1%; VOLTAGE_CONTINUOUS: 31.62V; VOLTAGE_MAX: 75V
R39 = HyTechDevices:RESISTOR_GND_*; RESISTANCE: 1.24k
R40-R42 = HyTechDevices:RESISTOR_GND_*; RESISTANCE: 10k
R44 = HyTechDevices:RESISTOR_?_*: Resistor PWR163 Series AC Series PU Series ERA Series PWR263 Series RC Series ERJ PB3, PB6 Series ERJ PA2, P03, PA3, P06, P08, P14 Series; DKPN: P20936TR-ND; MANUFACTURER: Panasonic Electronic Components; MOPN: 667-ERJ-PB6B1004V; MPN: ERJ-PB6B1004V; POWER: 0.25W; RESISTANCE: 1M; TOLERANCE: 0.1%; VOLTAGE_CONTINUOUS: 150V; VOLTAGE_MAX: 150V
R45 = HyTechDevices:RESISTOR_?_*: Resistor PWR163 Series AC Series PU Series ERA Series PWR263 Series RC Series ERJ PB3, PB6 Series ERJ PA2, P03, PA3, P06, P08, P14 Series; DKPN: YAG1651TR-ND; MANUFACTURER: Yageo; MOPN: 603-RT0603BRD073K32L; MPN: RT0603BRD073K32L; POWER: 0.1W; RESISTANCE: 3.32k; TOLERANCE: 0.1%; VOLTAGE_CONTINUOUS: 18.22V; VOLTAGE_MAX: 75V
R46 = HyTechDevices:RESISTOR_?_*: Resistor PWR163 Series AC Series PU Series ERA Series PWR263 Series RC Series ERJ PB3, PB6 Series ERJ PA2, P03, PA3, P06, P08, P14 Series; DKPN: P20904TR-ND; MANUFACTURER: Panasonic Electronic Components; MOPN: 667-ERJ-PB6B5233V; MPN: ERJ-PB6B5233V; POWER: 0.25W; RESISTANCE: 523k; TOLERANCE: 0.1%; VOLTAGE_CONTINUOUS: 150V; VOLTAGE_MAX: 150V
R48 = HyTechDevices:RESISTOR_?_*: Resistor PWR163 Series AC Series PU Series ERA Series PWR263 Series RC Series ERJ PB3, PB6 Series ERJ PA2, P03, PA3, P06, P08, P14 Series; DKPN: RT0603BRE0775KL-ND; MANUFACTURER: Yageo; MOPN: 603-RT0603BRE0775KL; MPN: RT0603BRE0775KL; POWER: 0.1W; RESISTANCE: 75k; TOLERANCE: 0.1%; VOLTAGE_CONTINUOUS: 75V; VOLTAGE_MAX: 75V
R51 = HyTechDevices:RESISTOR_?_*: Resistor PWR163 Series AC Series PU Series ERA Series PWR263 Series RC Series ERJ PB3, PB6 Series ERJ PA2, P03, PA3, P06, P08, P14 Series; DKPN: P154KDBCT-ND; MANUFACTURER: Panasonic Electronic Components; MOPN: 667-ERA-3AEB1543V; MPN: ERA-3AEB1543V; POWER: 0.1W; RESISTANCE: 154k; TOLERANCE: 0.1%; VOLTAGE_CONTINUOUS: 75V; VOLTAGE_MAX: 75V
TP1-TP16 TP18-TP20 = HyTechDevices:TEST_POINT: Test Point; DKPN: 36-5015CT-ND; MANUFACTURER: Keystone Electronics; MOPN: 534-5015; MPN: 5015
U1 = HyTechDevices:LTC6994_*
U2 = HyTechDevices:VOLTAGE_REGULATOR_?_*: Voltage Regulators LDL1117S50R Datasheet NCP785AH120T1G; DKPN: 497-17240-1-ND; MANUFACTURER: STMicroelectronics; MOPN: 511-LDL1117S50R; MPN: LDL1117S50R
U10 = HyTechDevices:DCM4623TD2J13D0T70: 400W 300V to 12V step-down DC-DC converter Datasheet
U11 = HyTechDevices:RELAY_SOLIDSTATE_NC_?
U15 = HyTechDevices:LOGICGATE_INVERTER_: Inverter SN74LVC Datasheet; DKPN: 2156-SN74LVC1G04DCKR-ND; MANUFACTURER: Texas Instruments; MOPN: 595-SN74LVC1G04DCKR; MPN: SN74LVC1G04DCKR
U16 = HyTechDevices:LTC3639: LTC3639 Datasheet; DKPN: LTC3639EMSE#TRPBFTR-ND; MANUFACTURER: Analog Devices Inc.; MOPN: 584-LTC3639EMSETRPBF; MPN: LTC3639EMSE#TRPBF
U17 = HyTechDevices:VOLTAGE_REGULATOR_ADJ_*_?: Adjustable voltage regulators. LR8 Datasheet; DKPN: LR8K4-GTR-ND; MANUFACTURER: Microchip Technology; MOPN: 689-LR8K4-G; MPN: LR8K4-G
U18 U19 = HyTechDevices:ISO224*: ISO224*: Isolated precision amplifier ISO224A: Low-Grade ISO224B: High-Grade ISO224* Datasheet; DKPN: 296-52316-1-ND; MANUFACTURER: Texas Instruments; MOPN: 595-ISO224BDWVR; MPN: ISO224BDWVR
U$1 = HyTechDevices:RELAY_SOLIDSTATE_NO_?: AQY214EH Normally Open Solid State Relay Datasheet <https://www.datasheetq.com/datasheet-download/287654/1/Panasonic/AQY214EH>
U$31 U$33 = HyTechDevices:CONNECTOR-5_?_*